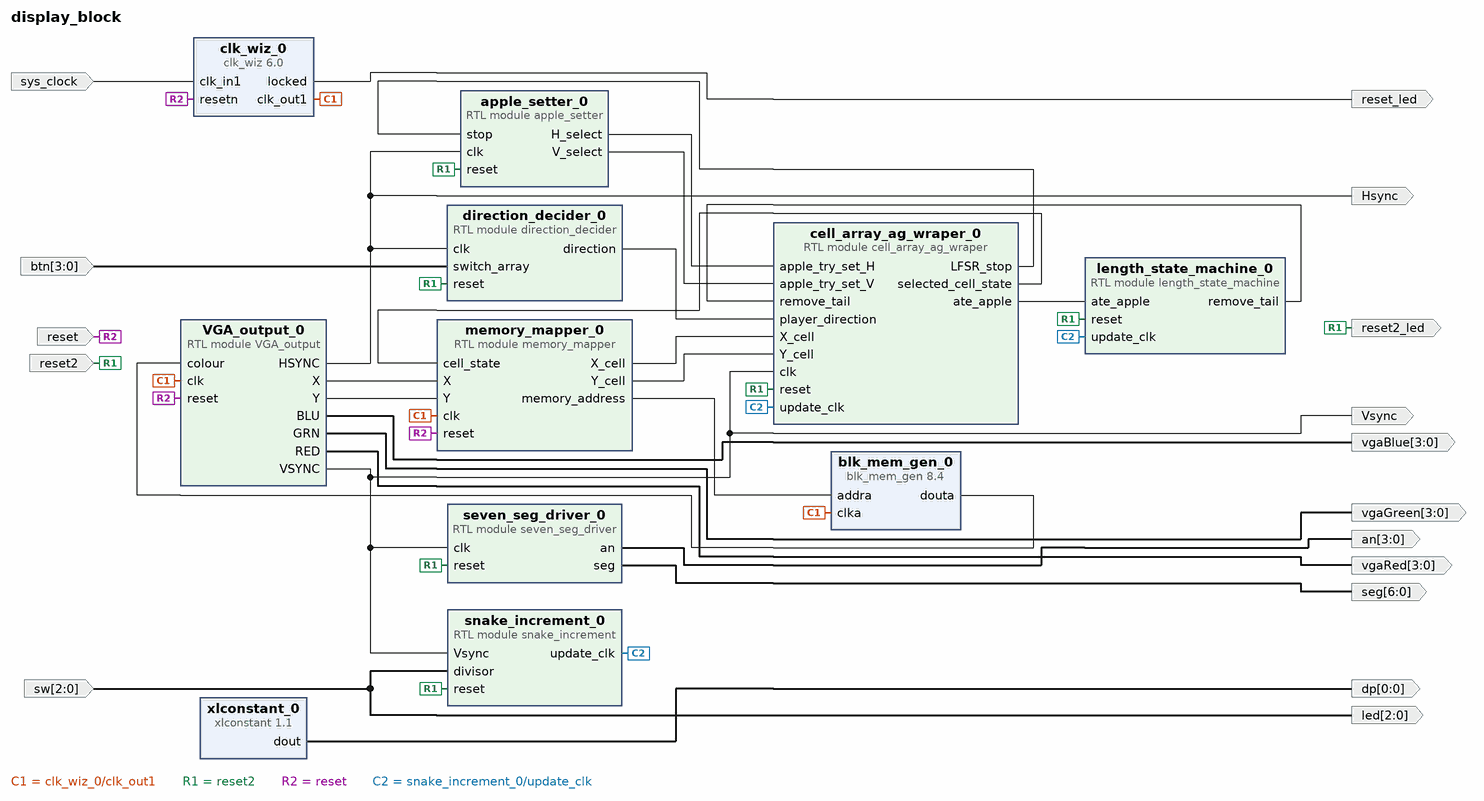
[diagram p0: block diagram of the top level]
# Vivado block design display_block, xc7a35tcpg236-1, Vivado 2024.2
create_bd_design display_block

create_bd_port -dir I -type rst reset
set_property -dict {CONFIG.POLARITY ACTIVE_LOW} [get_bd_ports reset]
create_bd_port -dir I -type clk sys_clock
set_property -dict {CONFIG.FREQ_HZ 100000000 CONFIG.PHASE 0.000} [get_bd_ports sys_clock]
create_bd_port -dir O Hsync
create_bd_port -dir O Vsync
create_bd_port -dir O -from 3 -to 0 vgaRed
create_bd_port -dir O -from 3 -to 0 vgaGreen
create_bd_port -dir O -from 3 -to 0 vgaBlue
create_bd_port -dir I -from 2 -to 0 sw
create_bd_port -dir O reset_led
create_bd_port -dir I -from 3 -to 0 btn
create_bd_port -dir O -from 2 -to 0 led
create_bd_port -dir I reset2
create_bd_port -dir O reset2_led
create_bd_port -dir O -from 6 -to 0 seg
create_bd_port -dir O -from 3 -to 0 an
create_bd_port -dir O -from 0 -to 0 dp

create_bd_cell -type ip -vlnv xilinx.com:ip:clk_wiz:6.0 clk_wiz_0
set_property -dict [list \
  CONFIG.CLKOUT1_JITTER 498.922 \
  CONFIG.CLKOUT1_PHASE_ERROR 578.639 \
  CONFIG.CLKOUT1_REQUESTED_OUT_FREQ 85.86 \
  CONFIG.CLKOUT1_REQUESTED_PHASE 6 \
  CONFIG.JITTER_SEL Min_O_Jitter \
  CONFIG.MMCM_BANDWIDTH HIGH \
  CONFIG.MMCM_CLKFBOUT_MULT_F 52.375 \
  CONFIG.MMCM_CLKOUT0_DIVIDE_F 7.625 \
  CONFIG.MMCM_CLKOUT0_PHASE 5.902 \
  CONFIG.MMCM_DIVCLK_DIVIDE 8 \
  CONFIG.RESET_PORT resetn \
  CONFIG.RESET_TYPE ACTIVE_LOW \
] [get_bd_cells clk_wiz_0]
create_bd_cell -type ip -vlnv xilinx.com:ip:blk_mem_gen:8.4 blk_mem_gen_0
set_property -dict [list \
  CONFIG.Algorithm Minimum_Area \
  CONFIG.Coe_File ../../../../../images/memory_config_all_ordered.COE \
  CONFIG.Disable_Collision_Warnings false \
  CONFIG.Disable_Out_of_Range_Warnings false \
  CONFIG.Enable_32bit_Address false \
  CONFIG.Enable_A Always_Enabled \
  CONFIG.Fill_Remaining_Memory_Locations true \
  CONFIG.Load_Init_File true \
  CONFIG.Memory_Type Single_Port_ROM \
  CONFIG.Port_A_Write_Rate 0 \
  CONFIG.Register_PortA_Output_of_Memory_Core true \
  CONFIG.Register_PortA_Output_of_Memory_Primitives false \
  CONFIG.Use_REGCEA_Pin false \
  CONFIG.Use_RSTA_Pin false \
  CONFIG.Write_Depth_A 4032 \
  CONFIG.Write_Width_A 12 \
  CONFIG.use_bram_block Stand_Alone \
] [get_bd_cells blk_mem_gen_0]
create_bd_cell -type module -reference VGA_output VGA_output_0
create_bd_cell -type module -reference memory_mapper memory_mapper_0
create_bd_cell -type module -reference cell_array_ag_wraper cell_array_ag_wraper_0
create_bd_cell -type module -reference length_state_machine length_state_machine_0
create_bd_cell -type module -reference apple_setter apple_setter_0
create_bd_cell -type module -reference snake_increment snake_increment_0
create_bd_cell -type module -reference direction_decider direction_decider_0
create_bd_cell -type module -reference seven_seg_driver seven_seg_driver_0
create_bd_cell -type ip -vlnv xilinx.com:ip:xlconstant:1.1 xlconstant_0
set_property -dict {CONFIG.CONST_VAL 0} [get_bd_cells xlconstant_0]

# ---- connections ----

connect_bd_net [get_bd_pins VGA_output_0/BLU] [get_bd_ports vgaBlue]
connect_bd_net [get_bd_pins VGA_output_0/GRN] [get_bd_ports vgaGreen]
connect_bd_net [get_bd_pins VGA_output_0/HSYNC] [get_bd_ports Hsync] [get_bd_pins direction_decider_0/clk] [get_bd_pins apple_setter_0/clk]
connect_bd_net [get_bd_pins VGA_output_0/RED] [get_bd_ports vgaRed]
connect_bd_net [get_bd_pins VGA_output_0/VSYNC] \
  [get_bd_ports Vsync] [get_bd_pins cell_array_ag_wraper_0/clk] [get_bd_pins snake_increment_0/Vsync] \
  [get_bd_pins seven_seg_driver_0/clk]
connect_bd_net -net VGA_output_0_X_ahead [get_bd_pins VGA_output_0/X] [get_bd_pins memory_mapper_0/X]
connect_bd_net -net VGA_output_0_Y_ahead [get_bd_pins VGA_output_0/Y] [get_bd_pins memory_mapper_0/Y]
connect_bd_net [get_bd_pins apple_setter_0/H_select] [get_bd_pins cell_array_ag_wraper_0/apple_try_set_H]
connect_bd_net [get_bd_pins apple_setter_0/V_select] [get_bd_pins cell_array_ag_wraper_0/apple_try_set_V]
connect_bd_net [get_bd_pins blk_mem_gen_0/douta] [get_bd_pins VGA_output_0/colour]
connect_bd_net [get_bd_ports btn] [get_bd_pins direction_decider_0/switch_array]
connect_bd_net [get_bd_pins cell_array_ag_wraper_0/LFSR_stop] [get_bd_pins apple_setter_0/stop]
connect_bd_net [get_bd_pins cell_array_ag_wraper_0/ate_apple] [get_bd_pins length_state_machine_0/ate_apple]
connect_bd_net [get_bd_pins cell_array_ag_wraper_0/selected_cell_state] [get_bd_pins memory_mapper_0/cell_state]
connect_bd_net [get_bd_pins clk_wiz_0/clk_out1] [get_bd_pins blk_mem_gen_0/clka] [get_bd_pins VGA_output_0/clk] [get_bd_pins memory_mapper_0/clk]
connect_bd_net [get_bd_pins clk_wiz_0/locked] [get_bd_ports reset_led]
connect_bd_net [get_bd_pins direction_decider_0/direction] [get_bd_pins cell_array_ag_wraper_0/player_direction]
connect_bd_net [get_bd_pins length_state_machine_0/remove_tail] [get_bd_pins cell_array_ag_wraper_0/remove_tail]
connect_bd_net [get_bd_pins memory_mapper_0/X_cell] [get_bd_pins cell_array_ag_wraper_0/X_cell]
connect_bd_net [get_bd_pins memory_mapper_0/Y_cell] [get_bd_pins cell_array_ag_wraper_0/Y_cell]
connect_bd_net -net memory_mapper_0_adress [get_bd_pins memory_mapper_0/memory_address] [get_bd_pins blk_mem_gen_0/addra]
connect_bd_net -net reset2_1 [get_bd_ports reset2] \
  [get_bd_pins cell_array_ag_wraper_0/reset] [get_bd_pins length_state_machine_0/reset] [get_bd_ports reset2_led] \
  [get_bd_pins direction_decider_0/reset] [get_bd_pins snake_increment_0/reset] [get_bd_pins apple_setter_0/reset] \
  [get_bd_pins seven_seg_driver_0/reset]
connect_bd_net [get_bd_ports reset] [get_bd_pins clk_wiz_0/resetn] [get_bd_pins VGA_output_0/reset] [get_bd_pins memory_mapper_0/reset]
connect_bd_net [get_bd_pins seven_seg_driver_0/an] [get_bd_ports an]
connect_bd_net [get_bd_pins seven_seg_driver_0/seg] [get_bd_ports seg]
connect_bd_net [get_bd_pins snake_increment_0/update_clk] \
  [get_bd_pins length_state_machine_0/update_clk] [get_bd_pins cell_array_ag_wraper_0/update_clk]
connect_bd_net [get_bd_ports sw] [get_bd_ports led] [get_bd_pins snake_increment_0/divisor]
connect_bd_net [get_bd_ports sys_clock] [get_bd_pins clk_wiz_0/clk_in1]
connect_bd_net [get_bd_pins xlconstant_0/dout] [get_bd_ports dp]

set_property USER_COMMENTS.comment_1 {changeing the switch input rapidaly can corrupt the memory
not a problem for the final design, but good to keep in mind} [current_bd_design]
set_property USER_COMMENTS.comment_0 {angle is set to get frequency just right} [current_bd_design]

validate_bd_design
save_bd_design
